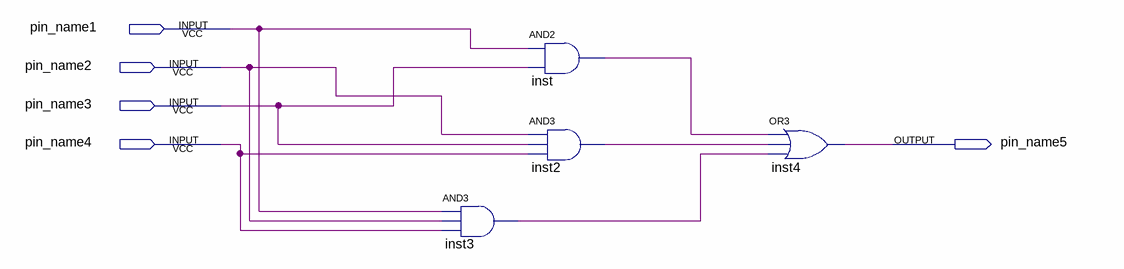
[diagram p0: schematic sheet]
// Quartus schematic c2.bdf as structural Verilog: 4 symbols, 5 pins
module c2 (
  input  pin_name1,
  input  pin_name2,
  input  pin_name3,
  input  pin_name4,
  output pin_name5
);

  wire inst2_out, inst3_out, inst_out;

  and inst3 (inst3_out, pin_name1, pin_name2, pin_name4);
  and inst (inst_out, pin_name1, pin_name3);
  and inst2 (inst2_out, pin_name2, pin_name3, pin_name4);
  or inst4 (pin_name5, inst_out, inst2_out, inst3_out);
endmodule
